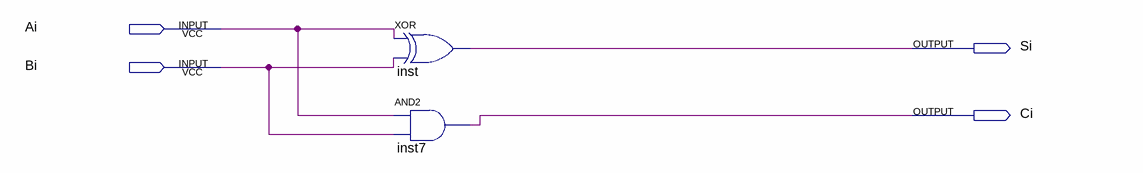
[diagram p0: schematic sheet]
// Quartus schematic Add_demi.bdf as structural Verilog: 2 symbols, 4 pins
module Add_demi (
  input  Ai,
  input  Bi,
  output Si,
  output Ci
);

  xor inst (Si, Ai, Bi);
  and inst7 (Ci, Ai, Bi);
endmodule
